# EasyEDA Pro project 直插数字功率隔离辅助电源.epro

# Schematic Schematic3
Board Name: Board1辅助电源板卡; Create Date: 2026-01-25; Page Name: P1; Project Name: 逆变集成板; Schematic Name: Schematic3; Update Date: 2026-01-25; Company: Werner; Page Size: A4; Version: V1.0
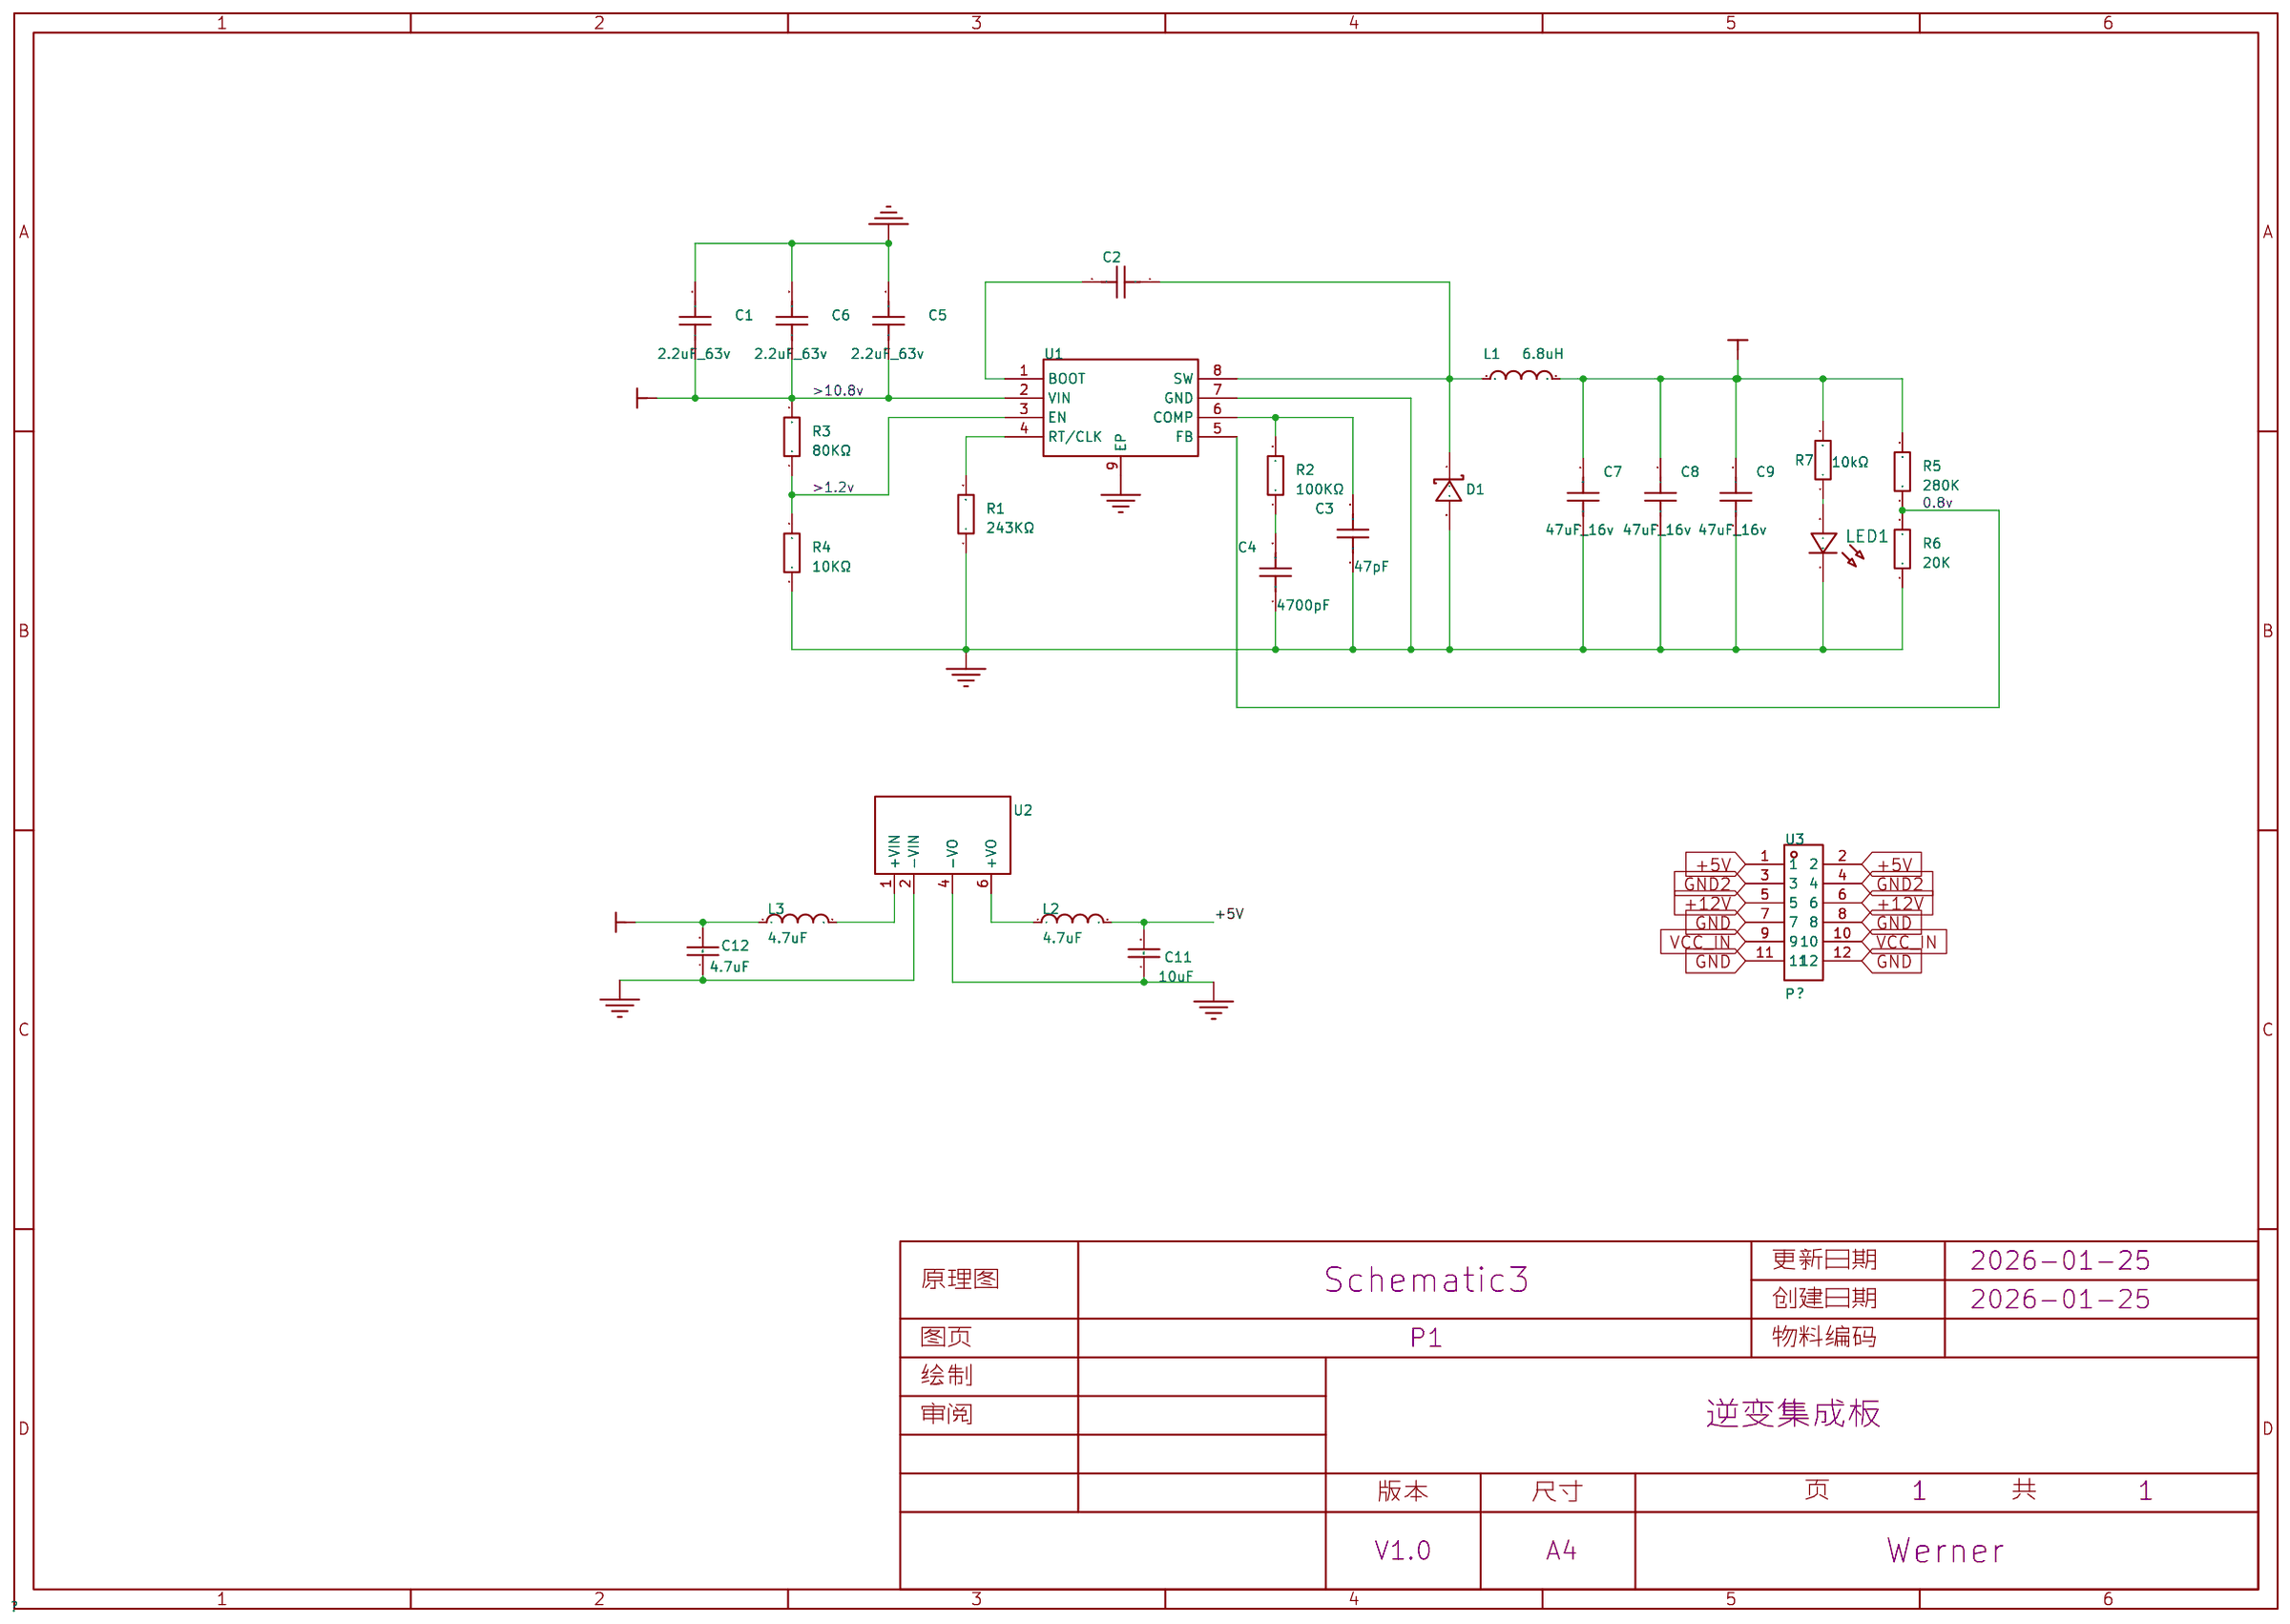
[diagram p0: schematic sheet]

## Parts
C1  2.2uF_63v  [C0805]
C2  100nF  [C0603]
C3  47pF  [C0603]
C4  4700pF  [C0603]
C5  2.2uF_63v  [C0805]
C6  2.2uF_63v  [C0805]
C7  47uF_16v  [C0805]
C8  47uF_16v  [C0805]
C9  47uF_16v  [C0805]
C11  10uF  [C0603]
C12  4.7uF  [C0805]
D1  SS3200  [SMA_L4.3-W2.6-LS5.2-RD]
L1  6.8uH  [IND-SMD_L7.1-W6.6]
L2  4.7uF  [IND-SMD_L4.9-W4.4_MAPM0420F]
L3  4.7uF  [IND-SMD_L4.9-W4.4_MAPM0420F]
LED1  -  [LED_0603]
R1  243KΩ  [R0603]
R2  100KΩ  [R0603]
R3  80KΩ  [R0603]
R4  10KΩ  [R0603]
R5  280K  [R0603]
R6  20K  [R0603]
R7  10kΩ  [电阻（0603）]
U1  TPS54560DDAR  [SOIC-8_L5.0-W4.0-P1.27-LS6.0-BL-EP2.0]
U2  B1205S-2WR3  [PWRM-TH_4P-L19.7-W7.1_B1205S-2WR3]
U3  P？  [辅助电源双层贴片排针6X2P]

## Library data of the parts
C1 C5-C9 = CAP_0805: Supplier Footprint: 0805
C2-C4 = CAP_0603: Supplier Footprint: 0603
C11 C12 = C0603
D1 = SS3200: 正向压降(Vf):950mV@3A;直流反向耐压(Vr):200V;平均整流电流(Io):3A;; Supplier: LCSC; Manufacturer: MDD; Supplier Part: C65001; JLCPCB Part Class: 扩展库; LCSC Part Name: 电压:200V 电流:3A; Supplier Footprint: SMA(DO-214AC); Datasheet: https://atta.szlcsc.com/upload/public/pdf/source/20230314/A80AE34493C69B89E2F4B1712F433538.pdf; Forward Voltage (Vf@If): 950mV@3A; Reverse Voltage (Vr): 200V; Average Rectified Current (Io): 3A; Reverse Leakage Current (Ir): 200uA@200V
L1 = D0630HP-100MT: 电感值:10uH;精度:±20%;饱和电流(Isat):4.5A;类型:一体成型电感;; LCSC Part Name: 一体成型电感 0630-10UH 10uH ±20%; Supplier Part: C41410464; Manufacturer: DEYAN(德砚电子); Supplier Footprint: SMD,7.1x6.6mm; JLCPCB Part Class: 扩展库; Datasheet: https://atta.szlcsc.com/upload/public/pdf/source/20240919/F778D1314CA22AE212FE584D5C4D76CB.pdf; Supplier: LCSC; Tolerance: ±20%; Current - Saturation (Isat): 4.5A; DC Resistance (DCR): 68mΩ; Type: 一体成型电感
L2 L3 = HA42-100MTP01: 电感值:10uH;精度:±20%;额定电流:1.5A;饱和电流(Isat):1.8A;; LCSC Part Name: 10uH ±20% 1.8A; Supplier Part: C2936661; Manufacturer: FH(风华); Supplier Footprint: 0420; JLCPCB Part Class: 扩展库; Datasheet: https://atta.szlcsc.com/upload/public/pdf/source/20211228/DF5AAD1C624D1DACD739A51BD94418BC.pdf; Supplier: LCSC; Tolerance: ±20%; Rated Current: 1.5A; Saturation Current (Isat): 1.8A; DC Resistance (DCR): 200mΩ
LED1 = LED_0603-R: Supplier Footprint: 0603
R1-R6 = Res_0603: Supplier Footprint: 0603
R7 = 0805W8F5101T5E: 电阻类型:厚膜电阻;阻值:5.1kΩ;精度:±1%;功率:125mW;最大工作电压:150V;温度系数:±100ppm/℃;; LCSC Part Name: 5.1kΩ ±1% 125mW 厚膜电阻; Supplier Part: C27834; Manufacturer: UNI-ROYAL(厚声); Supplier Footprint: 0805; JLCPCB Part Class: Basic Part; Datasheet: https://atta.szlcsc.com/upload/public/pdf/source/20200306/C422600_1E6D84923E4A46A82E41ADD87F860B5C.pdf; Supplier: LCSC; Type: 厚膜电阻; Tolerance: ±1%; Power(Watts): 125mW; Overload Voltage (Max): 150V; Temperature Coefficient: ±100ppm/℃; Operating Temperature Range: -55℃~+155℃
U1 = TPS54560DDAR: 功能类型:降压型;输出类型:可调;工作电压:4.5V~60V;输出电压:800mV~58.8V;输出电流:5A;; LCSC Part Name: 4.5V至60V输入,5A降压DC-DC转换器; Supplier Part: C31966; Manufacturer: TI(德州仪器); Supplier Footprint: SOIC-8-EP; JLCPCB Part Class: 扩展库; Datasheet: https://www.ti.com/cn/lit/gpn/tps54560; Supplier: LCSC; Function: 降压型; Output Type: 可调; Input Voltage: 4.5V~60V; Output Voltage: 800mV~58.8V; Output Current: 5A; Switching Frequency: 2.5MHz; Operating Temperature: -40℃~+150℃@(TJ); Synchronous Rectification: 否; Number of Outputs: 1; Topology: 降压式; Switch tube (built-in/external): 内置
U2 = B1205S-2WR3_C2992387: B1205S-2WR3是专门针对板上电源系统中需要产生一组与输入电源隔离的电压的应用场合而设计的。该产品适用于：1）输入电源的电压比较稳定（电压变化范围±10%Vin）；2）输入输出之间要求隔离（隔离电压≤1500VDC）；3）对输出电压稳定度要求不高；4）典型应用：纯数字电路场合，一般低频模拟电路场合，继电器驱动电路，数据交换电路场合等特点：定电压输入，隔离非稳压输出，2W，隔离电压：1500VDC，效率：高达 84%。; LCSC Part Name: 2W定电压输入隔离非稳压单路输出DC/DC电源模块; Supplier Part: C2992387; Manufacturer: YLPTEC(易川); Supplier Footprint: SIP,19.5x7mm; JLCPCB Part Class: 扩展库; Datasheet: https://item.szlcsc.com/datasheet/B1205S-2WR3/3456890.html; Supplier: LCSC; Type: 降压型; Number of Channels: 1; Output Power: 2W; Voltage - Supply: 10.8V~13.2V; Conversion Efficiency: 82%; Output Voltage: 5V; Output Current(Max): 400mA; Capacitive Load(Max): 2400uF; Isolation Voltage(Vrms): 1.5kV; Features: 短路保护；低功耗
U3 = 辅助电源双层贴片排针6X2P

## Nets
+5V: C11.2 L2.2 U3.1 U3.2
+12V: C7.2 C8.2 C9.2 C12.2 L1.2 L3.1 R5.2 R7.2 U3.5 U3.6
GND: C1.2 C3.1 C4.1 C5.2 C6.2 C7.1 C8.1 C9.1 C12.1 D1.2(A) LED1.1(C) R1.1 R4.1 R6.1 U1.7(GND) U1.9(EP) U2.2(-VIN) U3.7 U3.8 U3.11 U3.12
GND2: C11.1 U2.4(-VO) U3.3 U3.4
VCC_IN: C1.1 C5.1 C6.1 R3.2 U1.2(VIN) U3.9 U3.10
$1N1: L2.1 U2.6(+VO)
$1N4: L3.2 U2.1(+VIN)
$1N7: R5.1 R6.2 U1.5(FB)
$1N9: R3.1 R4.2 U1.3(EN)
$1N10: C3.2 R2.2 U1.6(COMP)
$1N11: C4.2 R2.1
$1N13: C2.2 U1.1(BOOT)
$1N15: R1.2 U1.4(RT/CLK)
$1N16: C2.1 D1.1(K) L1.1 U1.8(SW)
$1N31: LED1.2(A) R7.1

## Notes on the sheet
- >10.8v
- >1.2v
- 0.8v

# Board PCB3
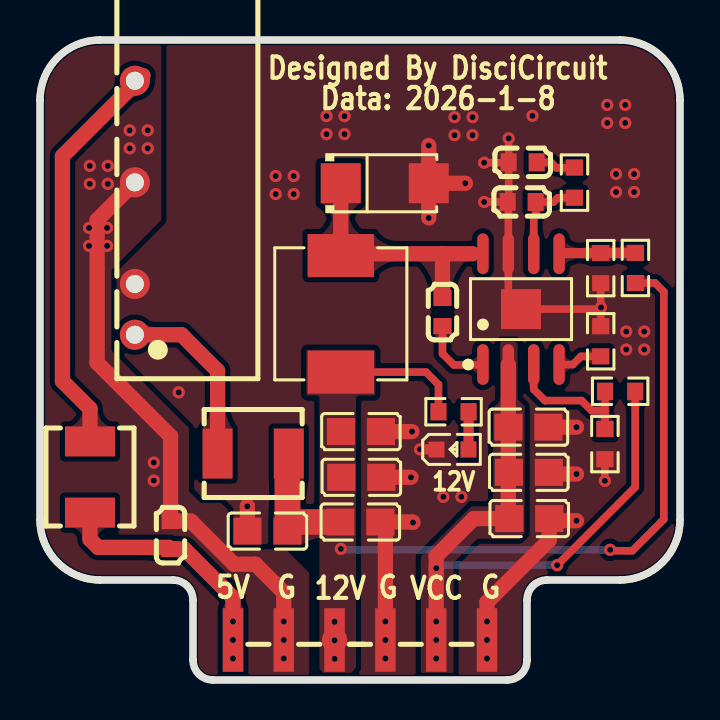
[diagram p1: board, top side]
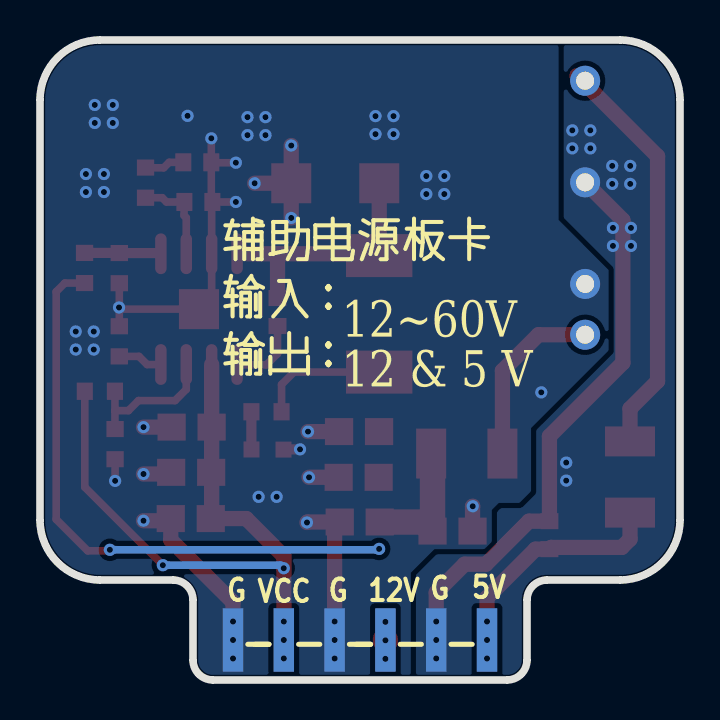
[diagram p2: board, bottom side, seen from below]

Outline 32 x 32 mm; copper layers: Top Layer, Bottom Layer. Coordinates in mm from the lower left corner of the outline.
Outline path: 0,29 arc(0.88,31.12) 3,32 29,32 arc(31.12,31.12) 32,29 32,8 arc(31.12,5.88) 29,5 25.35,5 arc(24.64,4.71) 24.35,4 24.35,1 arc(24.06,0.29) 23.35,0 8.65,0 arc(7.94,0.29) 7.65,1 7.65,4 arc(7.36,4.71) 6.65,5 3,5 arc(0.88,5.88) 0,8 0,29
Stack: Top Layer 0.035mm / Dielectric1 1.51mm FR4 er 4.5 / Bottom Layer 0.035mm

## Design rules (mm)
spacing copperThickness1oz (default): track to track 0.102, other pairs 0.152 to 0.3
spacing copperThickness2oz: track to track 0.203, other pairs 0.152 to 0.3
track width copperThickness1oz (default): min 0.127, default 0.254, max 2.54
track width copperThickness2oz: min 0.203, default 0.254, max 2.54
differential pair differentialPair (default): width min 0.127, default 0.254, max 2.54; gap min 0.152, default 0.152
net GND uses copperRegion

## Placement (name value [footprint] x y rotation side)
C1  2.2uF_63v  [C0805]  24.46 8.07 0 top
C2  100nF  [C0603]  20.12 18.4 270 top
C3  47pF  [C0603]  24.08 23.9 0 top
C4  4700pF  [C0603]  24.13 25.88 0 top
C5  2.2uF_63v  [C0805]  24.42 12.64 0 top
C6  2.2uF_63v  [C0805]  24.44 10.38 0 top
C7  47uF_16v  [C0805]  16.02 7.9 180 top
C8  47uF_16v  [C0805]  16.05 12.42 180 top
C9  47uF_16v  [C0805]  16.07 10.13 180 top
C11  10uF  [C0603]  6.53 7.24 270 top
C12  4.7uF  [C0805]  11.37 7.45 0 top
D1  SS3200  [SMA_L4.3-W2.6-LS5.2-RD]  17.24 24.84 0 top
L1  6.8uH  [IND-SMD_L7.1-W6.6]  15.04 18.31 270 top
L2  4.7uF  [IND-SMD_L4.9-W4.4_MAPM0420F]  2.5 10.15 270 top
L3  4.7uF  [IND-SMD_L4.9-W4.4_MAPM0420F]  10.66 11.32 180 top
LED1  -  [LED_0603]  20.68 11.53 0 top
R1  243KΩ  [R0603]  28.03 16.93 270 top
R2  100KΩ  [R0603]  26.72 24.87 270 top
R3  80KΩ  [R0603]  29.01 14.44 0 top
R4  10KΩ  [R0603]  28.25 11.79 90 top
R5  280K  [R0603]  29.77 20.6 270 top
R6  20K  [R0603]  28.03 20.59 90 top
R7  10kΩ  [电阻（0603）]  20.68 13.41 180 top
U1  TPS54560DDAR  [SOIC-8_L5.0-W4.0-P1.27-LS6.0-BL-EP2.0]  24.05 18.54 0 top
U2  B1205S-2WR3  [PWRM-TH_4P-L19.7-W7.1_B1205S-2WR3]  4.74 23.61 90 top
U3  P？  [辅助电源双层贴片排针6X2P]  16 2 0 top

## Footprints (pads in the part's own frame, mm; a bottom-side part is the same pattern mirrored in y, then rotated)
C0603
  rect 0.8x0.9 smd: 1(-0.7,0) 2(0.7,0)
C0805
  rect 1.41x1.35 smd: 1(-1,0) 2(1,0)
IND-SMD_L4.9-W4.4_MAPM0420F
  rect 1.5x2.5 smd: 1(-1.78,0) 2(1.78,0)
IND-SMD_L7.1-W6.6
  rect 2.15x3.32 smd: 1(-2.913,0) 2(2.913,0)
LED_0603
  rect 0.8x0.8 smd: 1(-0.851,-0.01) 2(0.75,-0.005)
PWRM-TH_4P-L19.7-W7.1_B1205S-2WR3
  round 1.5 hole 0.9: 1(-6.35,0) 2(-3.81,0) 4(1.27,0) 6(6.35,0)
R0603
  rect 0.806x0.864 smd: 1(-0.753,0) 2(0.753,0)
SMA_L4.3-W2.6-LS5.2-RD
  rect 2x2 smd: 1(-2.2,0) 2(2.2,0)
SOIC-8_L5.0-W4.0-P1.27-LS6.0-BL-EP2.0
  oval 0.574x2.038 smd: 1(-1.905,-2.769) 2(-0.635,-2.769) 3(0.635,-2.769) 4(1.905,-2.769) 5(1.905,2.769) 6(0.635,2.769) 7(-0.635,2.769) 8(-1.905,2.769)
  rect 2x2 smd: 9(0,0)
电阻（0603）
  rect 0.806x0.864 smd: 1(-0.754,0) 2(0.752,0)
辅助电源双层贴片排针6X2P
  rect 1.02x3.17 smd: 1(-6.35,0.001) 3(-3.81,0.001) 5(-1.27,0.001) 7(1.27,0.001) 9(3.81,0.001) 11(6.35,0.001)
  rect 1.02x3.17 smd far side: 2(-6.35,0.001) 4(-3.81,0.001) 6(-1.27,0.001) 8(1.27,0.001) 10(3.81,0.001) 12(6.35,0.001)

## Nets
As in the schematic.

## Via types
v1: diameter 0.61, hole 0.305, Top Layer to Bottom Layer, 80 vias

## Routing (per net, layer and track width the routed paths; a pad name or vN(x,y) marks a point on that pad's centre or on a via; arc(x,y) is an arc through that point)
+5V: length 10.9
  Top Layer w0.762: v1(9.65,2.92) 9.65,4.12 7.22,6.54 C11.2 6.44,6.63 2.91,6.63 2.5,7.04 L2.2
  vias: v1(9.65,2) v1(9.65,1.08)
+12V: length 43.1
  Top Layer w0.381: R7.2 19.92,14.77 19.3,15.4 L1.2 ; R5.2 30.76,19.85 31.19,19.41 31.19,8.03 29.62,6.46 28.56,6.46 v1(28.51,6.51)
  Top Layer w1.27: C7.2 12.83,7.9 C12.2 12.37,11.26 L3.1 ; v1(14.73,1.98) U3.5
  Bottom Layer w0.381: v1(15.04,6.56) 15.09,6.51 v1(28.51,6.51)
  vias: v1(14.73,2.91) v1(14.73,1.06)
GND: length 48.4
  Top Layer w0.381: C3.1 23.42,23.87 U1.7 23.42,19.18 23.55,19.04 ; C3.1 v1(22.21,23.9) ; C3.1 23.43,23.95 C4.1 ; v1(22.21,25.86) 23.41,25.86 C4.1 ; R6.1 28.03,18.58 ; 28.03,18.58 28.05,18.59 v1(28.05,18.63) ; 28.03,18.58 R1.1 ; 28.03,18.58 28,18.54 U1.9 ; R4.1 v1(28.25,9.96) ; C4.1 v1(23.43,27.08)
  Top Layer w0.508: LED1.1 19.81,11.53 v1(19,11.53)
  Top Layer w0.762: v1(26.82,7.96) 25.57,7.96 C1.2 25.46,7 22.35,3.89 v1(22.35,2.92) v1(22.35,2) ; 23.55,19.04 U1.9 ; C12.1 10.37,8.68 v1(10.36,8.69) ; v1(18.65,7.88) 18.63,7.9 C7.1 17.27,7.65 v1(17.27,2.92) v1(17.27,2) ; v1(26.82,10.3) 25.52,10.3 C6.2 ; v1(26.82,12.64) C5.2 25.46,12.6 ; D1.2 v1(21.27,24.84) ; D1.2 v1(19.44,23.1) ; D1.2 v1(19.44,26.72) ; C8.1 v1(18.6,12.42) ; C9.1 v1(18.55,10.13)
  vias: v1(6.94,14.38) v1(11.79,25.2) v1(11.79,24.3) v1(12.69,25.2) v1(12.69,24.3) v1(14.33,28.19) v1(14.33,27.29) v1(15.23,28.19) v1(15.23,27.29) v1(17.27,1.08) v1(20.17,9.16) v1(20.73,28.14) v1(20.73,27.24) v1(21.07,9.16) v1(21.63,28.14) v1(21.63,27.24) v1(22.35,1.08) v1(24.62,28.21) v1(28.36,28.75) v1(28.36,27.85) v1(28.8,25.3) v1(28.8,24.4) v1(29.26,28.75) v1(29.26,27.85) v1(29.31,17.42) v1(29.31,16.52) v1(29.7,25.3) v1(29.7,24.4) v1(30.21,17.42) v1(30.21,16.52)
GND2: length 28.8
  Top Layer w0.762: U2.4 2.86,23 2.86,15.86 6.53,12.19 C11.1 7.55,7.94 9.7,5.79 10.77,5.79 12.19,4.37 v1(12.19,2.92) v1(12.19,2)
  vias: v1(2.49,25.7) v1(2.49,24.8) v1(2.45,22.61) v1(2.45,21.71) v1(3.39,25.7) v1(3.39,24.8) v1(3.35,22.61) v1(3.35,21.71) v1(4.48,27.48) v1(4.48,26.58) v1(5.38,27.48) v1(5.38,26.58) v1(5.69,10.87) v1(5.69,9.97) v1(12.19,1.08)
VCC_IN: length 32.8
  Top Layer w0.381: R3.2 29.76,9.64 v1(25.86,5.74)
  Top Layer w0.762: v1(19.81,2) v1(19.81,2.92) 19.81,6.19 21.69,8.07 C1.1 23.42,8.12 U1.2
  Bottom Layer w0.381: v1(19.81,5.59) 19.97,5.74 v1(25.86,5.74)
  vias: v1(19.81,1.08)
$1N1: length 20.5
  Top Layer w0.762: 5.15,30.22 1.12,26.19 1.12,14.94 2.5,13.57 L2.1
$1N4: length 9
  Top Layer w0.762: U2.1 7.08,17.26 8.88,15.46 L3.2
$1N7: length 3.8
  Top Layer w0.508: U1.5 25.99,21.35 R6.2 28.04,21.35 R5.1
$1N9: length 7.1
  Top Layer w0.381: 28.25,13.47 27.58,13.47 27.08,13.97 25.25,13.97 24.69,14.53 U1.3 ; 28.25,13.47 28.25,12.56 R4.2 ; 28.25,13.47 R3.1
$1N10: length 4.7
  Top Layer w0.381: U1.6 24.69,23.11 24.8,23.22 24.8,23.89 C3.2 25.68,23.9 25.89,24.11 R2.2
$1N11: length 2
  Top Layer w0.381: C4.2 25.54,25.88 25.81,25.61 26.71,25.61 26.72,25.62
$1N13: length 3.6
  Top Layer w0.381: C2.2 20.12,16.31 20.68,15.76 22.13,15.76 U1.1
$1N15: length 2.3
  Top Layer w0.381: 28.1,16.18 27.05,16.18 26.64,15.77 U1.4
$1N16: length 12.5
  Top Layer w0.762: 20.12,21.31 15.13,21.31 L1.1 15.04,21.22 D1.1 ; 20.12,21.31 20.12,19.1 ; 20.12,21.31 21.62,21.31
$1N31: length 1.9
  Top Layer w0.508: LED1.2 21.43,11.53 R7.1

## Copper pours and planes (outline as drawn; the poured copper is in the pictures)
+12V on Top Layer: 13.31,16.51 16.76,16.51 16.76,0.36 13.31,0.36
GND on Top Layer: 13.46,-0.87 13.46,5.36 12.28,6.54 9.78,6.54 9.41,6.91 9.41,8.5 9.06,8.85 8.03,8.85 7.45,9.44 7.45,12.6 3.57,16.47 3.57,20.5 6.07,23 6.07,33.46 6.98,34.37 31.83,34.37 33.51,32.69 33.51,2.35 30.29,-0.87 13.46,-0.87
GND on Bottom Layer: 13.46,-0.87 13.46,5.36 12.28,6.54 9.78,6.54 9.41,6.91 9.41,8.5 9.06,8.85 8.03,8.85 7.45,9.44 7.45,12.6 3.57,16.47 3.57,20.5 6.07,23 6.07,33.46 6.98,34.37 31.83,34.37 33.51,32.69 33.51,2.35 30.29,-0.87 13.46,-0.87
GND2 on Top Layer: -3.77,33.35 -3.06,34.07 5.3,34.07 6.07,33.3 6.07,23 3.57,20.5 3.57,16.47 7.45,12.6 7.45,9.43 8.03,8.85 9.06,8.85 9.41,8.5 9.41,6.91 9.78,6.54 12.27,6.54 13.46,5.35 13.46,-2.09 12.04,-3.52 0.31,-3.52 -3.77,0.56
GND2 on Bottom Layer: -3.77,33.35 -3.06,34.07 5.3,34.07 6.07,33.3 6.07,23 3.57,20.5 3.57,16.47 7.45,12.6 7.45,9.43 8.03,8.85 9.06,8.85 9.41,8.5 9.41,6.91 9.78,6.54 12.27,6.54 13.46,5.35 13.46,-2.09 12.04,-3.52 0.31,-3.52 -3.77,0.56
VCC_IN on Top Layer: 19.04,16.92 24.23,16.92 24.23,0.36 19.04,0.36

Small or netless copper shapes (teardrops, artwork), in the pictures only: 84 on Top Layer, 4 on Bottom Layer

## Text on the board
Bottom Silkscreen Layer: 5V | G | 12V | VCC | 12~60V | 12 & 5 V | 辅助电源板卡 / 输入： / 输出：
Top Silkscreen Layer: 12V | 5V | Designed By DisciCircuit | G | Data: 2026-1-8 | VCC
